# EAGLE schematic Teensy + XBee (EAGLE 9.6.1)
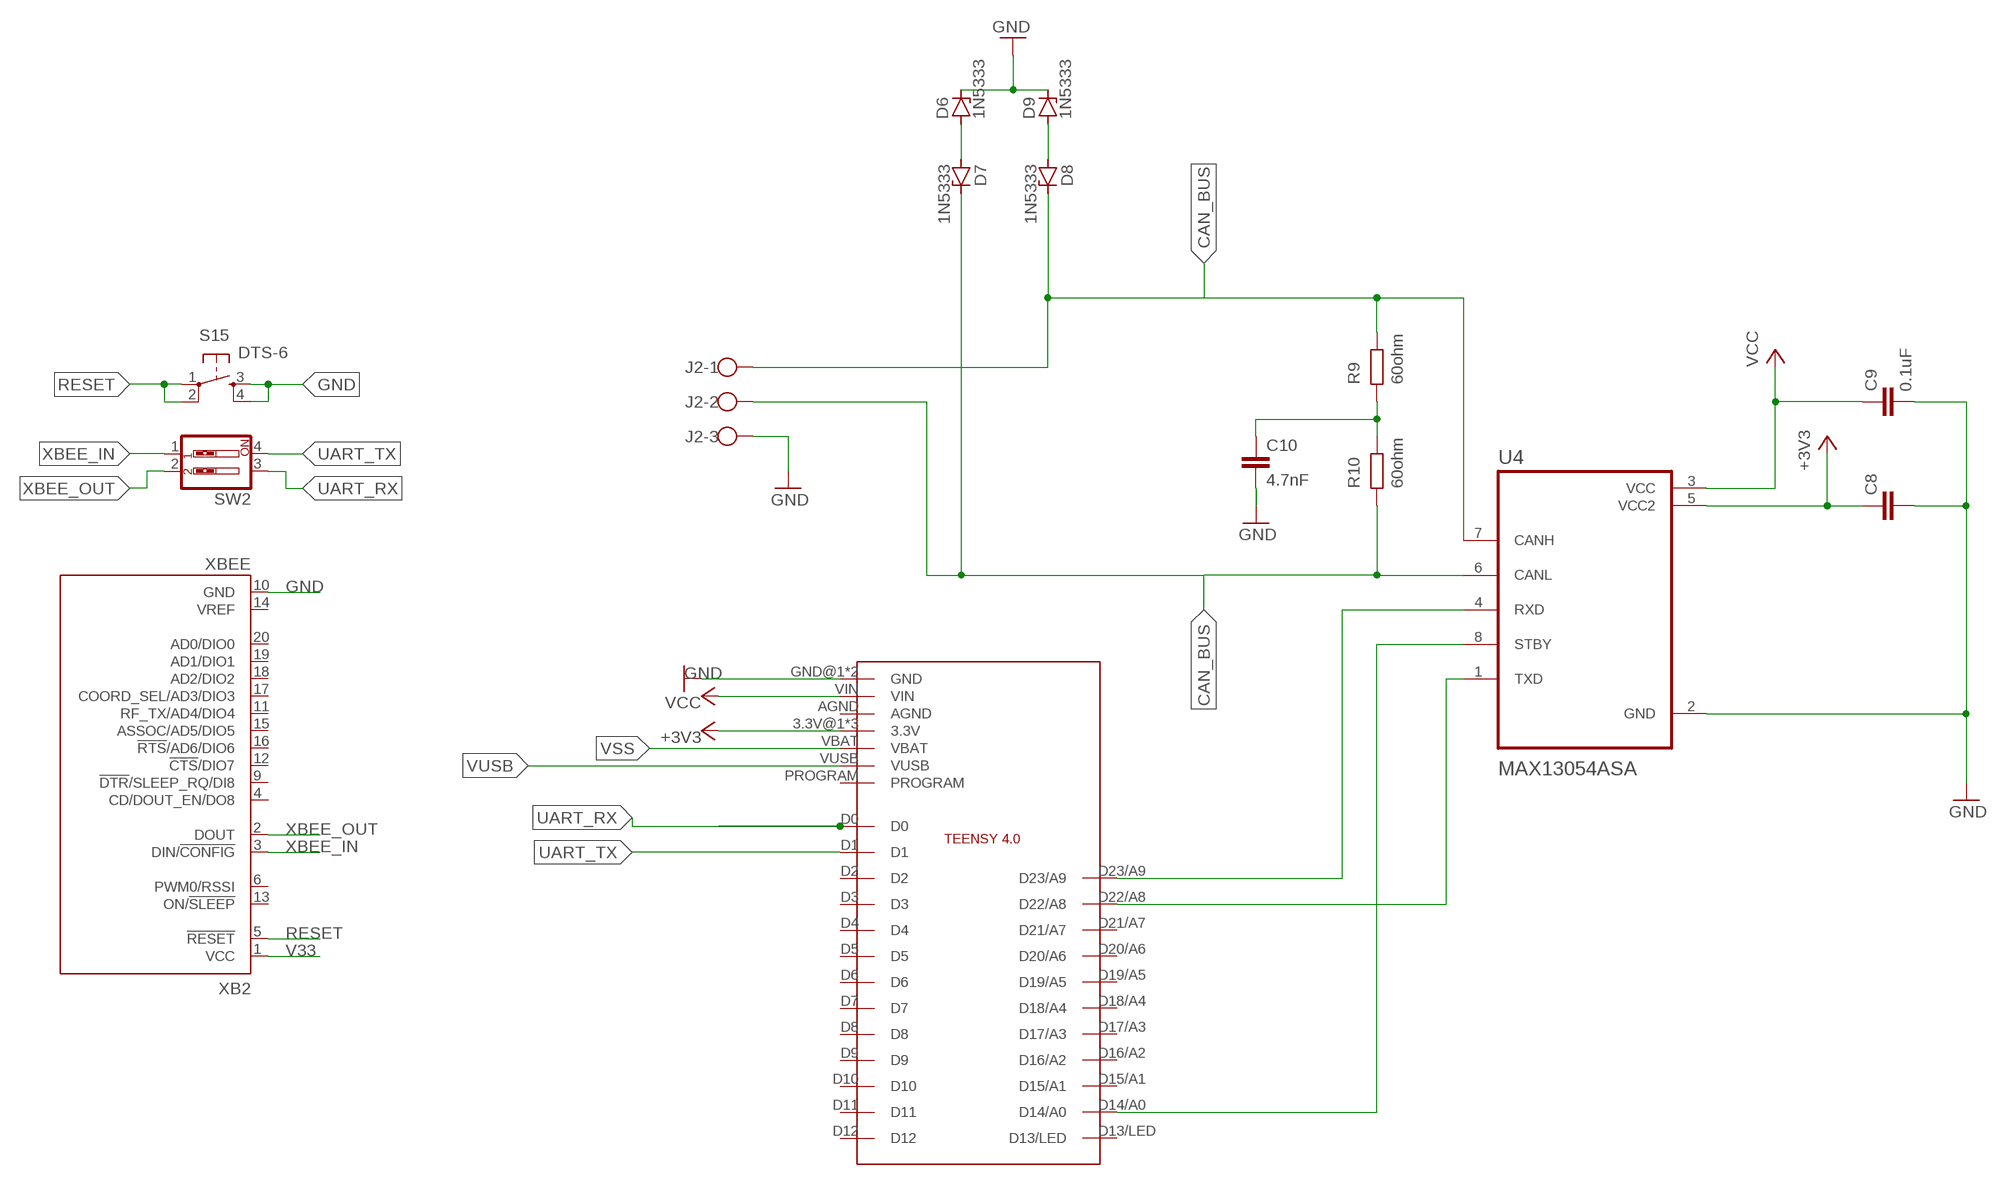
[diagram p0: schematic, sheet 1]

## Parts
C8  C2,5-3  [C2.5-3]
C9  0.1uF  C2,5-3  [C2.5-3]
C10  4.7nF  C2,5-3  [C2.5-3]
D6  1N5333  [C1702-15]
D7  1N5333  [C1702-15]
D8  1N5333  [C1702-15]
D9  1N5333  [C1702-15]
J2  W237-103  [W237-103]
R9  60ohm  R  (no package)
R10  60ohm  R  (no package)
S15  DTS-6  [DTS-6]
SW2  SW_DIP-2  [EDG-02]
U4  MAX13054ASA  [SOIC127P600X175-8N]
U$6  TEENSY4.0  [TEENSY4.0]
XB2  XBEE  [XBEE]

## Nets
+3V3: C8.1 U4.5(VCC2) U$6.3.3V@1(3.3V) U$6.3.3V@2(3.3V) U$6.ON/OFF(3.3V)
CAN_BUS: D8.C J2.1 R9.2 U4.7(CANH)
GND: C8.2 C9.2 C10.2 D6.C D9.C J2.3 S15.3 S15.4 U4.2(GND) U$6.GND@1(GND) U$6.GND@2(GND) XB2.10(GND)
N$3: D7.C J2.2 R10.1 U4.6(CANL)
N$40: U4.8(STBY) U$6.D14/A0
N$41: U4.4(RXD) U$6.D23/A9
N$42: U4.1(TXD) U$6.D22/A8
N$43: C10.1 R9.1 R10.2
N$44: D6.A D7.A
N$45: D8.A D9.A
RESET: S15.1 S15.2 XB2.5(!RESET)
UART_RX: SW2.3 U$6.D0
UART_TX: SW2.4 U$6.D1
V33: XB2.1(VCC)
VCC: C9.1 U4.3(VCC) U$6.VIN
VSS: U$6.VBAT
VUSB: U$6.VUSB
XBEE_IN: SW2.1 XB2.3(DIN/!CONFIG)
XBEE_OUT: SW2.2 XB2.2(DOUT)
Unconnected: U$6.AGND U$6.D2 U$6.D3 U$6.D4 U$6.D5 U$6.D6 U$6.D7 U$6.D8 U$6.D9 U$6.D10 U$6.D11 U$6.D12 U$6.D13/LED U$6.D15/A1 U$6.D16/A2 U$6.D17/A3 U$6.D18/A4 U$6.D19/A5 U$6.D20/A6 U$6.D21/A7 U$6.PROGRAM XB2.4(CD/DOUT_EN/DO8) XB2.6(PWM0/RSSI) XB2.9(!DTR!/SLEEP_RQ/DI8) XB2.11(RF_TX/AD4/DIO4) XB2.12(!CTS!/DIO7) XB2.13(ON/!SLEEP) XB2.14(VREF) XB2.15(ASSOC/AD5/DIO5) XB2.16(!RTS!/AD6/DIO6) XB2.17(COORD_SEL/AD3/DIO3) XB2.18(AD2/DIO2) XB2.19(AD1/DIO1) XB2.20(AD0/DIO0)

## Library data of the parts
C8-C10 = capacitor-wima:C: CAPACITOR naming: grid - package width
D6-D9 = diode:1N5333: Z DIODE 3.3 V, 5W, 5 percent (Motorola)
J2 = con-wago-500:W237-103: WAGO SCREW CLAMP; MPN: 237-103; OC_FARNELL: unknown; OC_NEWARK: 18M7116
R9 R10 = ngspice-simulation:R: RESISTOR
S15 = switch-tact:DTS-6
SW2 = special:SW_DIP-2: DIP SWITCH
U4 = MAX13054ASA:MAX13054ASA; DESCRIPTION: 1/1 Transceiver Full CANbus 8-SOIC; DIGI-KEY_PART_NUMBER: MAX13054ASA+TTR-ND; DIGI-KEY_PURCHASE_URL: https://www.digikey.com/product-detail/en/maxim-integrated/MAX13054ASA-T/MAX13054ASA-TTR-ND/1475460?utm_source=snapeda&utm_medium=aggregator&utm_campaign=symbol; MF: Maxim Integrated; MP: MAX13054ASA+; PACKAGE: SOIC-8 Maxim
U$6 = Teensy4.0:TEENSY4.0
XB2 = maxstream:XBEE: XBee (TM) /XBee-PRO(TM) OEM RF Modules Source: MaxStream, Inc. xbee_productmanual.pdf; MPN: XBP24-Z7UIT-004; OC_FARNELL: 1751799; OC_NEWARK: 34R5507

## Module RESISTER
Ports: 

### Library data of the parts

## Module GND
Ports: 

### Library data of the parts

## Module MOTOR
Ports: 

### Library data of the parts

## Module MOTORDRIVER
Ports: U(io) V(io) W(io) VCC(io) GND(io) 5V(io) GND1(io) HA(io) HB(io) HC(io) RS232(io) PWR(io) ALM(io) GND2(io) ALM1(io) X3(io) PG(io) X2(io) 5V1(io) X1(io) 5V2(io) PR(io) GND3(io) EN(io) BR(io)

### Library data of the parts